# Altium schematic sheet current_sensor.SchDoc
size A4
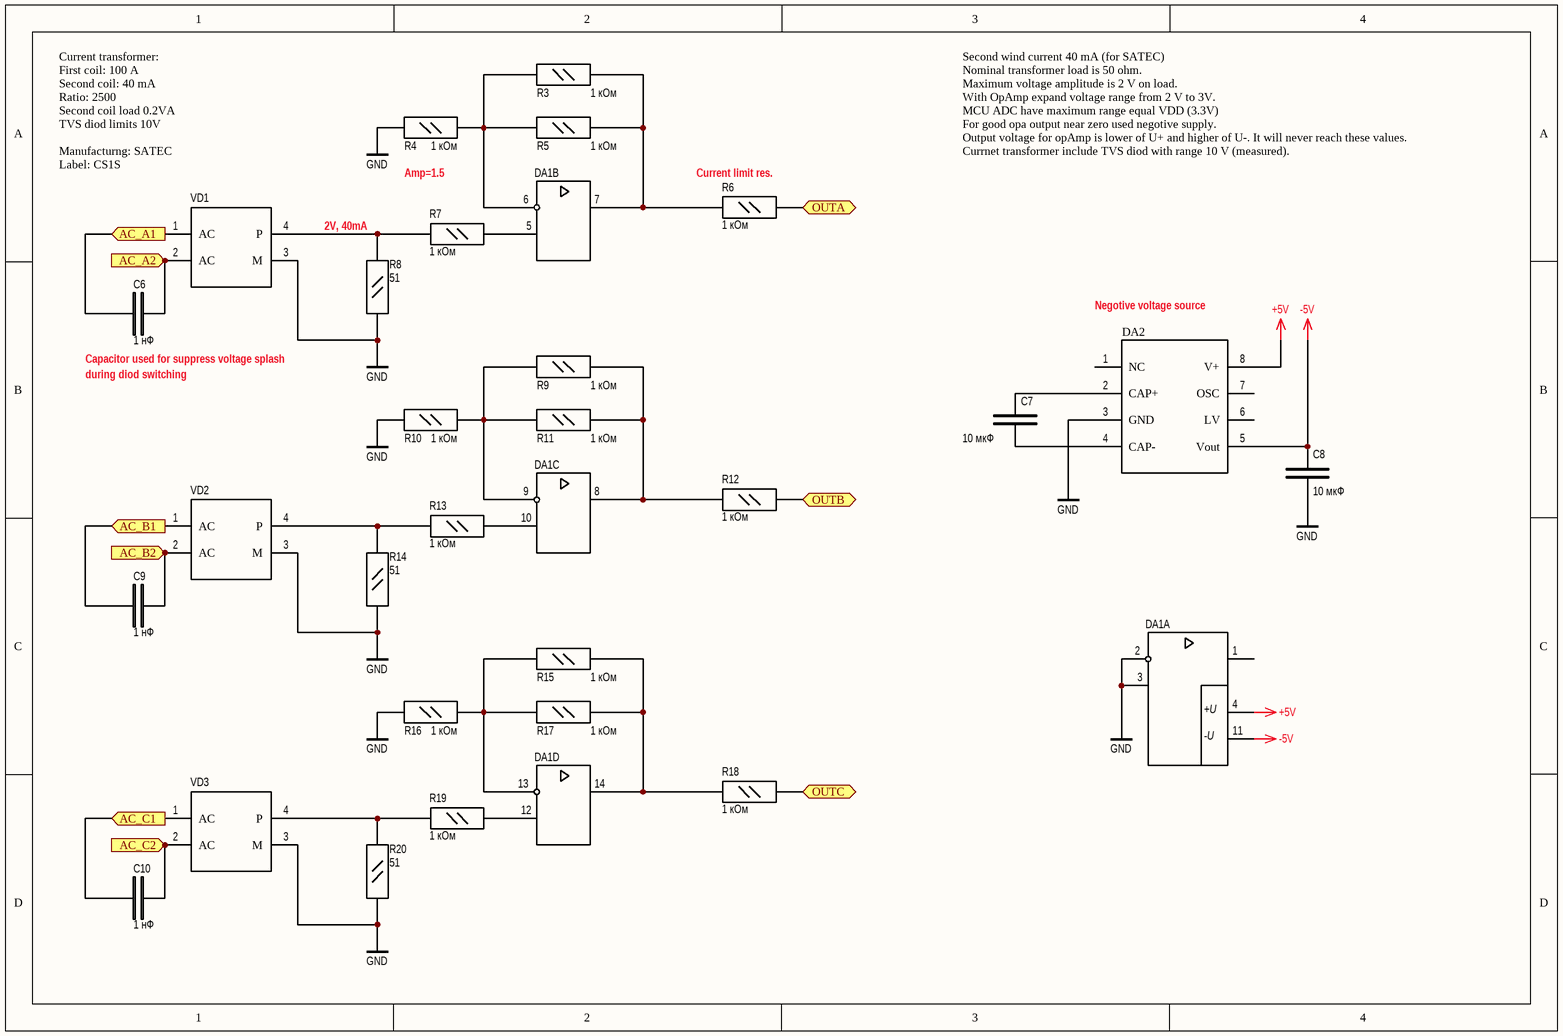
[diagram p0: current_sensor.SchDoc]

## Parts
C6  1 нФ  [CAP0402-LONG]
C7  10 мкФ  [CAP0805]
C8  10 мкФ  [CAP0805]
C9  1 нФ  [CAP0402-LONG]
C10  1 нФ  [CAP0402-LONG]
DA1  ?  [SO-14]  (value not drawn)  (parts A,B,C,D of 4)
DA2  ICL7660A  [So-8]  (value not drawn)
R3  value 1 кОм  [RES0402-LONG]  (hidden comment: RES0805)
R4  value 1 кОм  [RES0402-LONG]  (hidden comment: RES0805)
R5  value 1 кОм  [RES0402-LONG]  (hidden comment: RES0805)
R6  value 1 кОм  [RES0402-LONG]  (hidden comment: RES0805)
R7  value 1 кОм  [RES0402-LONG]  (hidden comment: RES0805)
R8  value 51  [RES0805]  (hidden comment: Резистор 0.125Вт)
R9  value 1 кОм  [RES0402-LONG]  (hidden comment: RES0805)
R10  value 1 кОм  [RES0402-LONG]  (hidden comment: RES0805)
R11  value 1 кОм  [RES0402-LONG]  (hidden comment: RES0805)
R12  value 1 кОм  [RES0402-LONG]  (hidden comment: RES0805)
R13  value 1 кОм  [RES0402-LONG]  (hidden comment: RES0805)
R14  value 51  [RES0805]  (hidden comment: Резистор 0.125Вт)
R15  value 1 кОм  [RES0402-LONG]  (hidden comment: RES0805)
R16  value 1 кОм  [RES0402-LONG]  (hidden comment: RES0805)
R17  value 1 кОм  [RES0402-LONG]  (hidden comment: RES0805)
R18  value 1 кОм  [RES0402-LONG]  (hidden comment: RES0805)
R19  value 1 кОм  [RES0402-LONG]  (hidden comment: RES0805)
R20  value 51  [RES0805]  (hidden comment: Резистор 0.125Вт)
VD1  DB-1MS  [DB1MA]  (value not drawn)
VD2  DB-1MS  [DB1MA]  (value not drawn)
VD3  DB-1MS  [DB1MA]  (value not drawn)

## Ports
AC_A1 (in), AC_A2 (in), AC_B1 (in), AC_B2 (in), AC_C1 (in), AC_C2 (in), OUTA (in), OUTB (in), OUTC (in)

## Nets
+5V: DA1.4(U+) DA2.8(V+)
-5V: C8.2 DA1.11(U-) DA2.5(Vout)
GND: C8.1 DA1.2(IN1-) DA1.3(IN1+) DA2.3(GND) R4.2 R8.1 R10.2 R14.1 R16.2 R20.1 VD1.3(M) VD2.3(M) VD3.3(M)
AC_A1: C6.1 VD1.1(AC) ; port AC_A1
AC_A2: C6.2 VD1.2(AC) ; port AC_A2
AC_B1: C9.1 VD2.1(AC) ; port AC_B1
AC_B2: C9.2 VD2.2(AC) ; port AC_B2
AC_C1: C10.1 VD3.1(AC) ; port AC_C1
AC_C2: C10.2 VD3.2(AC) ; port AC_C2
OUTA: R6.1 ; port OUTA
OUTB: R12.1 ; port OUTB
OUTC: R18.1 ; port OUTC
NetC7_1: C7.1 DA2.4(CAP-)
NetC7_2: C7.2 DA2.2(CAP+)
NetDA1_5: DA1.5(IN2+) R7.1
NetDA1_6: DA1.6(IN2-) R3.2 R4.1 R5.2
NetDA1_7: DA1.7(OUT2) R3.1 R5.1 R6.2
NetDA1_8: DA1.8(OUT3) R9.1 R11.1 R12.2
NetDA1_9: DA1.9(IN3-) R9.2 R10.1 R11.2
NetDA1_10: DA1.10(IN3+) R13.1
NetDA1_12: DA1.12(IN4+) R19.1
NetDA1_13: DA1.13(IN4-) R15.2 R16.1 R17.2
NetDA1_14: DA1.14(OUT4) R15.1 R17.1 R18.2
NetR7_2: R7.2 R8.2 VD1.4(P)
NetR13_2: R13.2 R14.2 VD2.4(P)
NetR19_2: R19.2 R20.2 VD3.4(P)

Not connected (* = marked no-connect by the designer): DA1 1(OUT1); DA2 1(NC) 6(LV) 7(OSC)

## Notes on the sheet
- Current transformer:
  First coil: 100 A
  Second coil: 40 mA
  Ratio: 2500
  Second coil load 0.2VA
  TVS diod limits 10V
  Manufacturng: SATEC
  Label: CS1S
- Amp=1.5
- (near R6) Current limit res.
- Second wind current 40 mA (for SATEC)
  Nominal transformer load is 50 ohm.
  Maximum voltage amplitude is 2 V on load.
  With OpAmp expand voltage range from 2 V to 3V.
  MCU ADC have maximum range equal VDD (3.3V)
  For good opa output near zero used negotive supply.
  Output voltage for opAmp is lower of U+ and higher of U-. It will never reach these values.
  Currnet transformer include TVS diod with range 10 V (measured).
- (near R8) 2V, 40mA
- (near DA2) Negotive voltage source
- Capacitor used for suppress voltage splash
- during diod switching
- (in symbol LM324, part A) +U; -U

## Library data of the parts
C6-C10 = CAP0805: Конденсатор
  C6 C9 C10: value: 1 нФ; price: 0.1
  C7 C8: value: 10 мкФ; price: 1
DA1 = LM324: Low Power Quad Operational Amplifiers; Type: ?; Value: ?
DA2 = ICL7660A: PartNumber: ICL7660A,ICL7660AIBAZA-T; Shop 1: Терраэлектроника; Shop 2: Элитан; Price 1: 58 ( 1 шт); Price 2: 164 ( от 10 шт); Link 1: https://www.terraelectronica.ru/product/866952; Link 2: https://www.elitan.ru/price/item155984395
R3-R7 R9-R13 R15-R19 = RES0805: Резистор 0805; price: 0.1
VD1-VD3 = DB-1MS: Type: ?; value: ?